# EAGLE design ST1S14 (EAGLE 8.6.3)
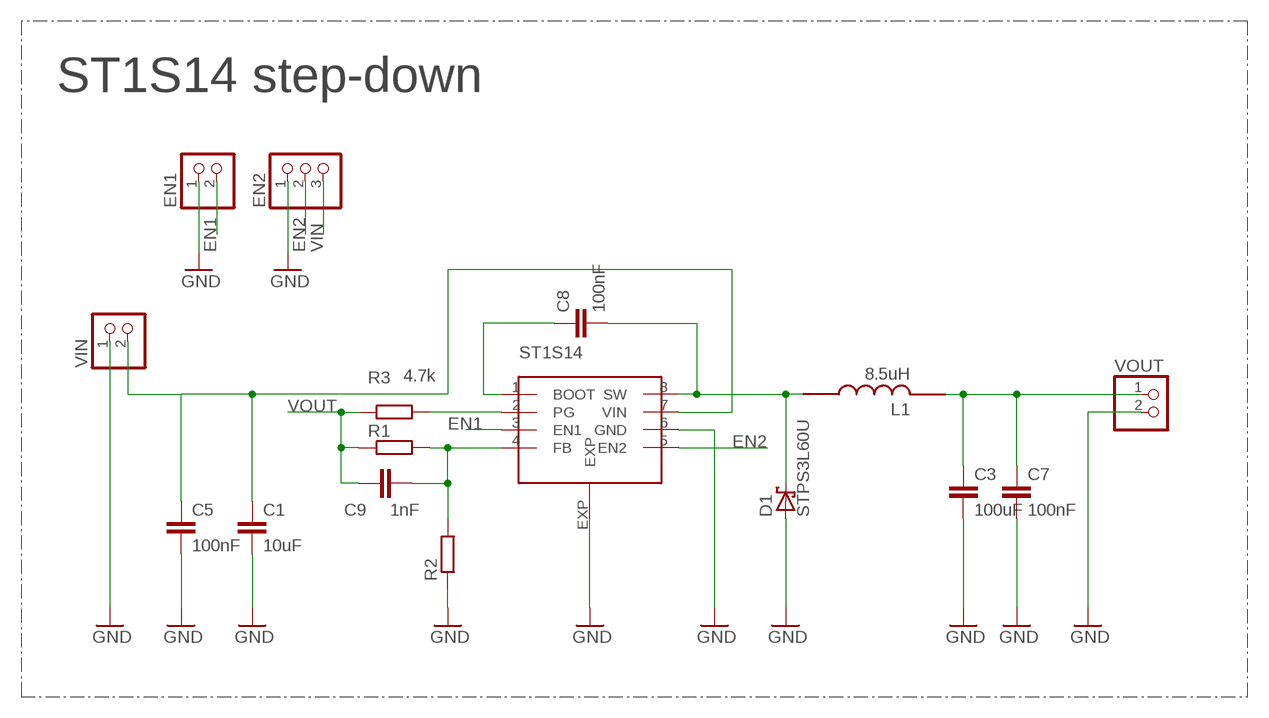
[diagram p0: schematic, sheet 1]

## Parts
C1  10uF  C-EUC1210K  [C1210K]
C3  100uF  C-EUC1210K  [C1210K]
C5  100nF  C-EUC0603  [C0603]
C7  100nF  C-EUC0603  [C0603]
C8  100nF  C-EUC0603  [C0603]
C9  1nF  C-EUC0603  [C0603]
D1  STPS3L60U  MBRS130LT3  [SMB]
EN1  PINHD-1X2  [1X02]
EN2  PINHD-1X3  [1X03]
L1  8.5uH  COIL8.5  [COIL1]
R1  R-EU_R0603  [R0603]
R2  R-EU_R0603  [R0603]
R3  4.7k  R-EU_R0603  [R0603]
U$1  ST1S14  [HSOP8]
VIN  PINHD-1X2  [1X02]
VOUT  PINHD-1X2  [1X02]

## Nets
EN1: EN1.2 U$1.3(EN1)
EN2: EN2.2 U$1.5(EN2)
GND: C1.2 C3.2 C5.2 C7.2 D1.A EN1.1 EN2.1 R2.1 U$1.6(GND) U$1.EXP VIN.1 VOUT.2
N$1: C8.1 U$1.1(BOOT)
N$2: C9.2 R1.2 R2.2 U$1.4(FB)
N$3: C8.2 D1.C L1.1 U$1.8(SW)
N$7: R3.2 U$1.2(PG)
VIN: C1.1 C5.1 EN2.3 U$1.7(VIN) VIN.2
VOUT: C3.1 C7.1 C9.1 L1.2 R1.1 R3.1 VOUT.1

## Notes on the sheet
- ST1S14 step-down

## Library data of the parts
C1 C3 C5 C7-C9 = rcl:C-EU: CAPACITOR, European symbol; SPICEPREFIX: C
D1 = diode:MBRS130LT3: Schottky Power Rectifier Source: http://www.onsemi.com/pub/Collateral/MBRS130LT3-D.PDF; SPICEPREFIX: D
EN1 VIN VOUT = pinhead:PINHD-1X2: PIN HEADER
EN2 = pinhead:PINHD-1X3: PIN HEADER
L1 = _elementy:COIL8.5
R1-R3 = rcl:R-EU_: RESISTOR, European symbol; SPICEPREFIX: R
U$1 = _układy:ST1S14

## Board
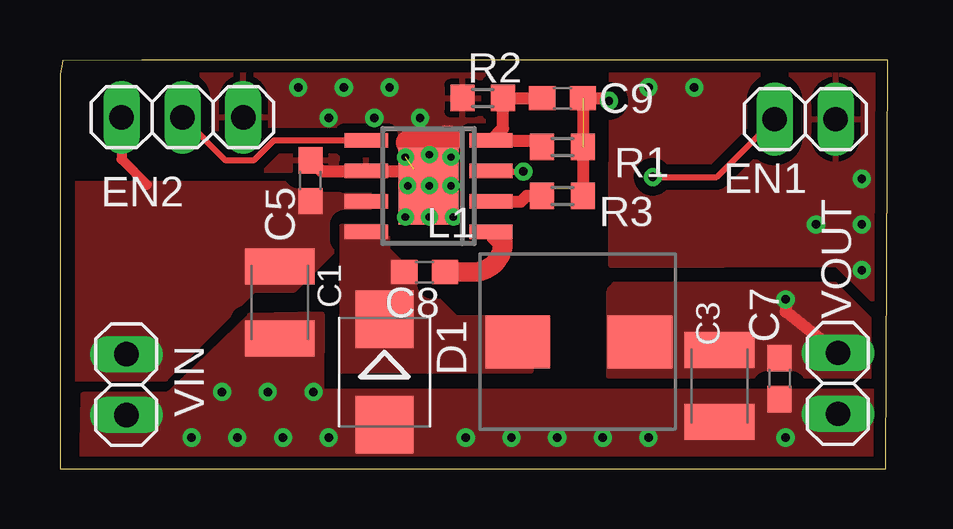
[diagram p1: board, top side]
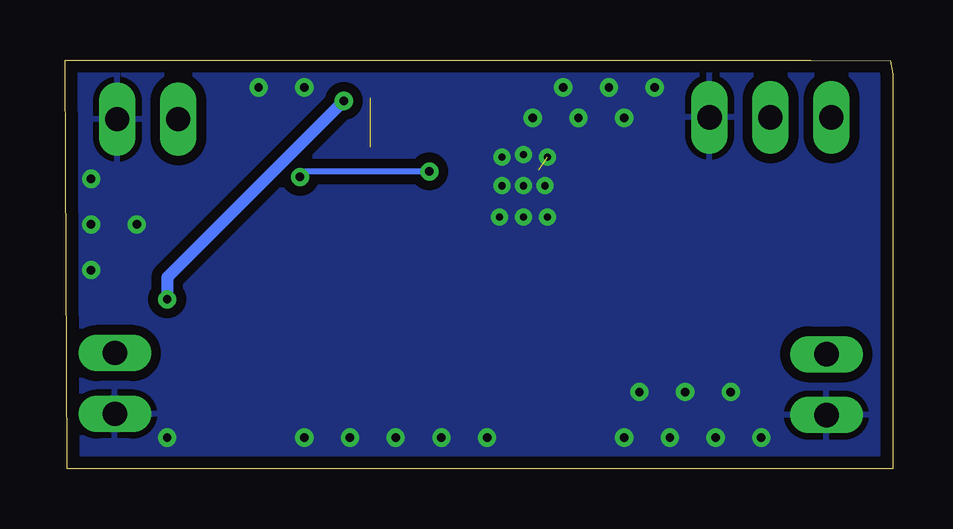
[diagram p2: board, bottom side, seen from below]

Size 34.5 x 17.05 mm. Coordinates in mm from the lower left corner, seen from the top.
Outline: 0,0 34.43,0 34.5,17.05 33.12,17.05 22.3,17.03 3.41,17.03 0.11,17.02 0,16.46 0,0
Copper layers (1*16): Top 0.035mm / dielectric 1.5mm / Bottom 0.035mm
Design rules "default *": minimum track width 6mil, minimum drill 0.3mm, track to track 6mil, track to pad 6mil, pad to pad 6mil, via to via 6mil, smd to smd 6mil, copper to edge 20mil, drill to drill 6mil, minimum pad ring 10mil, minimum via ring 8mil, stop-mask expansion 4mil, vias tented up to drill 50mil, thermal gap 10mil

### Footprints (pad centres in the part's own frame; a part is rotated, then mirrored left to right if it is on the bottom)
C1210K = smd 1.5 x 2.9: 1 -1.5,0; 2 1.5,0
C0603 = smd 1.1 x 1: 1 -0.85,0; 2 0.85,0
SMB = smd 2.4 x 2.4: A 2.2,0; C -2.2,0
1X02 = drill 1.016 long: 1 -1.27,0; 2 1.27,0
1X03 = drill 1.016 long: 1 -2.54,0; 2 0,0; 3 2.54,0
COIL1 = smd 2.7 x 2.2: 1 -2,0; 2 3.1,0
R0603 = smd 1 x 1.1: 1 -0.85,0; 2 0.85,0
HSOP8 = smd 0.6 x 1.8: 1 -1.905,-2.6; 2 -0.635,-2.6; 3 0.635,-2.6; 4 1.905,-2.6; 5 1.905,2.6; 6 0.635,2.6; 7 -0.635,2.6; 8 -1.905,2.6 | smd 3.2 x 2.51: EXP 0,0

### Placement (x,y rotation side)
C1  9.17,6.93 270 top
C3  27.49,3.46 270 top
C5  10.44,12.01 90 top
C7  29.99,3.76 270 top
C8  15.2,8.2 180 top
C9  20.95,15.46 180 top
D1  13.53,4.03 270 top
EN1  31.06,14.58 180 top
EN2  5.11,14.66 180 top
L1  21.08,5.29 0 top
R1  20.95,13.42 180 top
R2  17.62,15.46 0 top
R3  20.95,11.38 180 top
U$1  15.37,11.79 90 top
VIN  2.77,3.51 90 top
VOUT  32.44,3.56 270 top

### Tracks (layer width: path | path; a pad name or v marks a point on that pad's centre or on a via)
EN1  (via drill 0.35)
  Top 0.254: U$1.3 17.99,12.39 v19.32,12.39 | v24.71,12.17 27.38,12.17 EN1.2
  Bottom 0.254: v19.32,12.39 24.48,12.39 v24.71,12.17
EN2
  Top 0.254: U$1.5 8.91,13.69 8.08,12.85 6.91,12.85 EN2.2
GND  (via drill 0.3, 0.35)  (1 unrouted)
  Top 0.508: C5.2 10.88,12.42 U$1.6 14.71,12.42 14.76,12.47
  Top 1.016: U$1.EXP 15.37,13.6 | 15.37,13.6 14.5,13.6 | 15.37,13.6 16.2,13.6 16.2,13.8 16.1,13.8 16.1,13.7
  other vias: 5.49,1.3 7.39,1.3 9.3,1.3 11.2,1.3 6.76,3.2 8.66,3.2 10.57,3.2 16.92,1.3 18.82,1.3 20.73,1.3 22.63,1.3 24.54,1.3 30.25,1.3 9.93,15.9 11.84,15.9 13.74,15.9 15.01,14.63 13.11,14.63 11.2,14.63 14.4,10.5 15.4,10.5 16.4,10.5 16.3,11.8 14.5,11.8 15.4,11.8 14.4,13 15.4,13.1 16.3,13 33.43,8.28 33.43,10.19 33.43,12.09 31.52,10.19 24.54,15.9 26.44,15.9
  pour Top (isolate 0.406, no thermals): 0.91,-0.05 34.57,-0.05 34.57,3.2 10.9,3.2 10.92,6.43 7.92,6.38 4.57,3.15 4.62,3.07 0.97,3.07
  pour Top (isolate 0.406): 34.47,17.12 34.47,6.5 32.41,8.51 22.99,8.48 23.01,17.12
  pour Top (isolate 0.406): 0.18,16.94 0.18,12.47 12.93,12.47 22.96,12.47 22.96,16.99 22.96,17.07 0.18,17.07
  pour Bottom (isolate 0.406): 0,17.07 0,-0.05 34.57,-0.05 34.57,17.07 0.08,17.07
N$1
  Top 0.508: 18.47,9.42 18.42,9.42 arc-90 U$1.1
  Top 0.813: C8.1 17.24,8.2 arc90 18.47,9.42
N$2
  Top 0.508: R1.2 19.83,13.69 U$1.4 18.47,14.2 R2.2 C9.2
N$3
  pour Top (isolate 0.61, no thermals): 11.76,10.08 11.76,4.09 19.63,4.09 19.63,6.27 16.51,6.27 13.67,9.12 13.67,10.21 13.64,10.24 11.84,10.24
N$7
  Top 0.508: R3.2 19.45,11.38 19.2,11.12 17.99,11.12 U$1.2
VIN
  Top 0.406: EN2.3 2.56,12.9 3.63,11.84
  pour Top (isolate 0.61, no thermals): 0.36,11.76 0.36,3.76 4.39,3.76 8.1,7.47 9.75,7.47 11.63,9.35 11.63,10.39 12.88,10.39 12.88,11.86 0.43,11.86
VOUT  (via drill 0.35)  (1 unrouted)
  Top 0.508: R3.1 C9.1 22.77,15.46 v22.89,15.34 | v30.25,7.06 30.25,6.55 VOUT.1
  Bottom 0.508: v22.89,15.34 30.25,7.98 v30.25,7.06
  pour Top (isolate 0.61, no thermals): 22.89,7.32 22.89,3.89 34.16,3.89 34.16,5.82 32.31,7.67 23.11,7.67 22.94,7.49